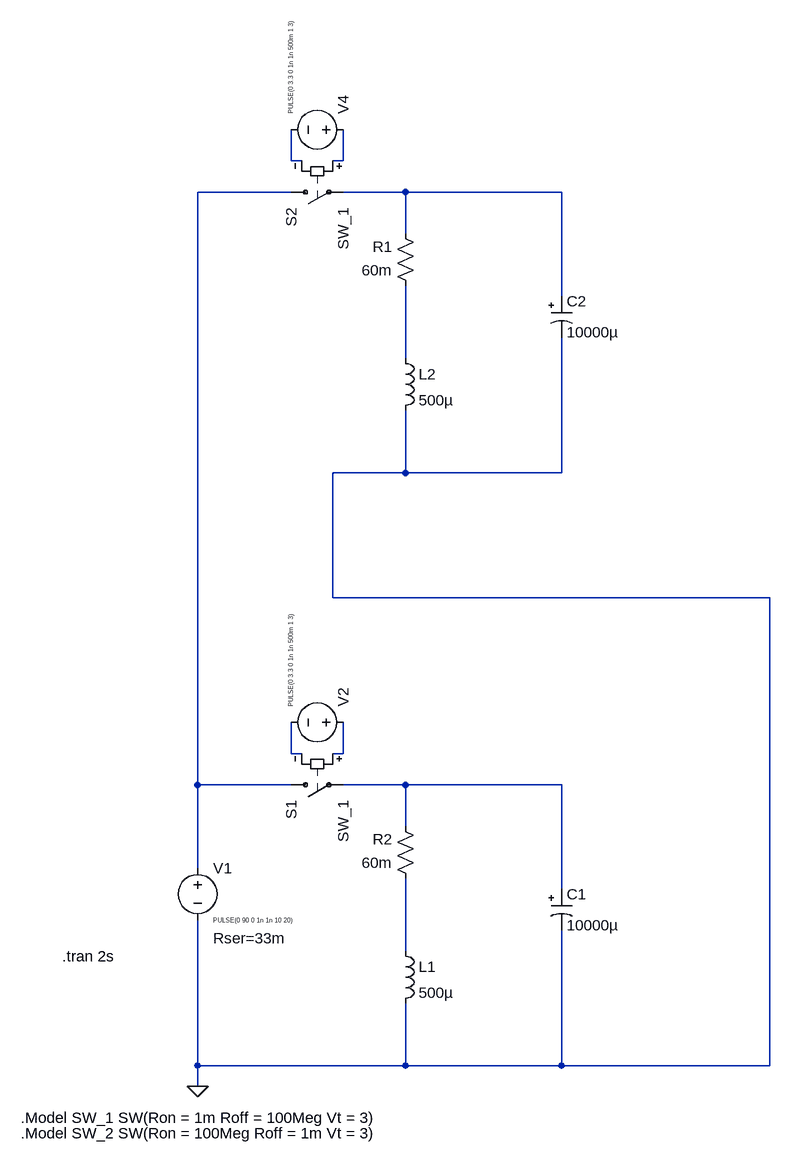
[diagram p0: schematic coilgun3.asc]
coilgun3.asc, the LTspice schematic file:
Version 4.1
SHEET 1 2368 680
WIRE 256 -960 256 -1008
WIRE 272 -960 256 -960
WIRE 336 -960 336 -1008
WIRE 336 -960 320 -960
WIRE 256 -912 112 -912
WIRE 432 -912 336 -912
WIRE 672 -912 432 -912
WIRE 432 -848 432 -912
WIRE 672 -752 672 -912
WIRE 432 -656 432 -768
WIRE 432 -480 432 -576
WIRE 432 -480 320 -480
WIRE 672 -480 672 -688
WIRE 672 -480 432 -480
WIRE 320 -288 320 -480
WIRE 992 -288 320 -288
WIRE 256 -48 256 -96
WIRE 272 -48 256 -48
WIRE 336 -48 336 -96
WIRE 336 -48 320 -48
WIRE 112 0 112 -912
WIRE 256 0 112 0
WIRE 432 0 336 0
WIRE 672 0 432 0
WIRE 432 64 432 0
WIRE 112 128 112 0
WIRE 672 160 672 0
WIRE 432 256 432 144
WIRE 112 432 112 208
WIRE 432 432 432 336
WIRE 432 432 112 432
WIRE 672 432 672 224
WIRE 672 432 432 432
WIRE 992 432 992 -288
WIRE 992 432 672 432
WIRE 112 464 112 432
FLAG 112 464 0
SYMBOL voltage 112 112 R0
WINDOW 123 0 0 Left 0
WINDOW 39 24 124 Left 2
WINDOW 3 24 96 Left 0
SYMATTR SpiceLine Rser=33m
SYMATTR Value PULSE(0 90 0 1n 1n 10 20)
SYMATTR InstName V1
SYMBOL sw 240 0 M90
SYMATTR InstName S1
SYMATTR Value SW_1
SYMBOL voltage 352 -96 M270
WINDOW 3 24 96 Left 0
WINDOW 123 0 0 Left 0
WINDOW 39 0 0 Left 0
SYMATTR InstName V2
SYMATTR Value PULSE(0 3.3 0 1n 1n 500m 1 3)
SYMBOL res 448 160 R180
WINDOW 0 36 76 Left 2
WINDOW 3 36 40 Left 2
SYMATTR InstName R2
SYMATTR Value 60m
SYMBOL polcap 656 160 R0
SYMATTR InstName C1
SYMATTR Value 10000µ
SYMBOL ind 416 240 R0
SYMATTR InstName L1
SYMATTR Value 500µ
SYMBOL sw 240 -912 M90
SYMATTR InstName S2
SYMATTR Value SW_1
SYMBOL voltage 352 -1008 M270
WINDOW 3 24 96 Left 0
WINDOW 123 0 0 Left 0
WINDOW 39 0 0 Left 0
SYMATTR InstName V4
SYMATTR Value PULSE(0 3.3 0 1n 1n 500m 1 3)
SYMBOL res 448 -752 R180
WINDOW 0 36 76 Left 2
WINDOW 3 36 40 Left 2
SYMATTR InstName R1
SYMATTR Value 60m
SYMBOL polcap 656 -752 R0
SYMATTR InstName C2
SYMATTR Value 10000µ
SYMBOL ind 416 -672 R0
SYMATTR InstName L2
SYMATTR Value 500µ
TEXT -96 264 Left 2 !.tran 2s
TEXT -160 512 Left 2 !.Model SW_1 SW(Ron = 1m Roff = 100Meg Vt = 3)
TEXT -160 536 Left 2 !.Model SW_2 SW(Ron = 100Meg Roff = 1m Vt = 3)

The netlist it stands for:
* coilgun3.asc
V1 N003 0 PULSE(0 90 0 1n 1n 10 20) Rser=33m
S1 N003 N008 N007 N006 SW_1
V2 N007 N006 PULSE(0 3.3 0 1n 1n 500m 1 3)
R2 N009 N008 60m
C1 N008 0 10000µ
L1 N009 0 500µ
S2 N003 N004 N002 N001 SW_1
V4 N002 N001 PULSE(0 3.3 0 1n 1n 500m 1 3)
R1 N005 N004 60m
C2 N004 0 10000µ
L2 N005 0 500µ
.tran 2s
.Model SW_1 SW(Ron = 1m Roff = 100Meg Vt = 3)
.Model SW_2 SW(Ron = 100Meg Roff = 1m Vt = 3)
.backanno
.end